# Altium schematic sheet SOM_IO1.SchDoc
size A4
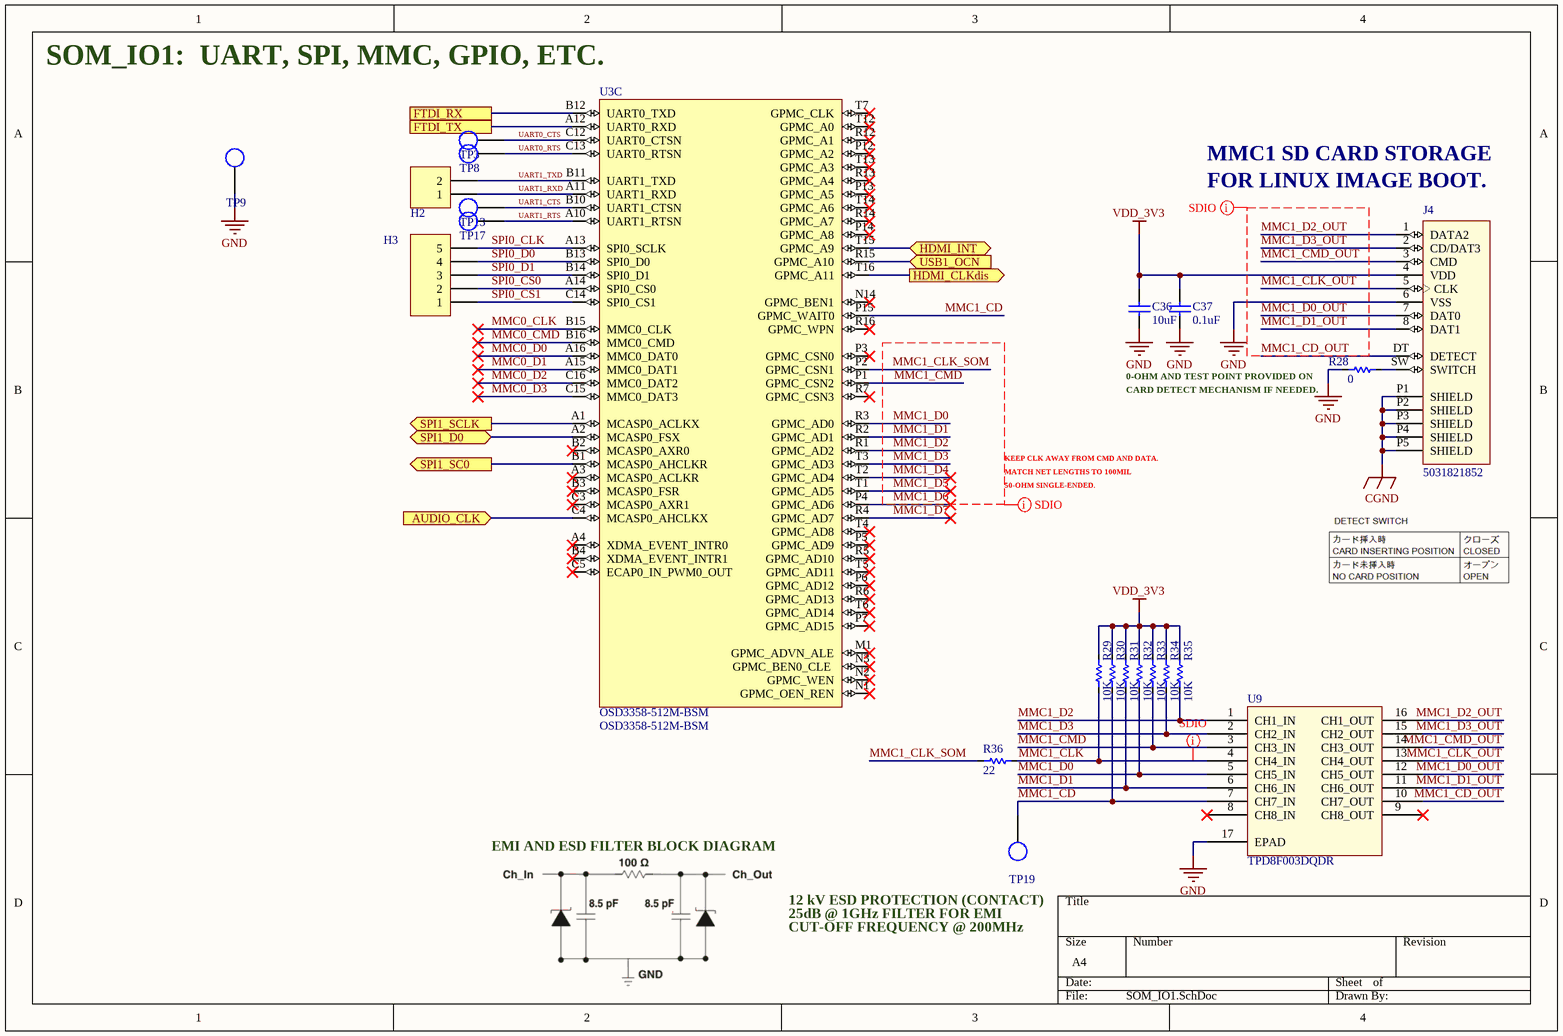
[diagram p0: SOM_IO1.SchDoc]

## Parts
C36  10uF  [CAP_0603]
C37  0.1uF  [CAP_0603]
H2  02p  [HEADER_2X1_2.54MM]  (value not drawn)
H3  06p  [HEADER_5X1_2.54MM]  (value not drawn)
J4  5031821852  [5031821852]
R28  0  [RES_0603]
R29  10K  [RES_0603]
R30  10K  [RES_0603]
R31  10K  [RES_0603]
R32  10K  [RES_0603]
R33  10K  [RES_0603]
R34  10K  [RES_0603]
R35  10K  [RES_0603]
R36  22  [RES_0603]
TP3  TP_SMD  [TP_SMD]  (value not drawn)
TP8  TP_SMD  [TP_SMD]  (value not drawn)
TP9  TP_SMD  [TP_SMD]  (value not drawn)
TP13  TP_SMD  [TP_SMD]  (value not drawn)
TP17  TP_SMD  [TP_SMD]  (value not drawn)
TP19  TP_SMD  [TP_SMD]  (value not drawn)
U3  OSD3358-512M-BSM  [BGA256C127P16X16_2100X2100X308]  (part C of 6)
U9  TPD8F003DQDR  [WSON-16_3.3MMX1.35MM]

## Ports
AUDIO_CLK (in), FTDI_RX, FTDI_TX, HDMI_CLKdis (out), HDMI_INT (bidir), SPI1_D0 (bidir), SPI1_SC0 (out), SPI1_SCLK (out), USB1_OCN (in)

## Nets
CGND: J4.P1(SHIELD) J4.P2(SHIELD) J4.P3(SHIELD) J4.P4(SHIELD) J4.P5(SHIELD)
GND: C36.1 C37.1 J4.6(VSS) R28.1 TP9.1 U9.17(EPAD)
VDD_3V3: C36.2 C37.2 J4.4(VDD) R29.2 R30.2 R31.2 R32.2 R33.2 R34.2 R35.2
AUDIO_CLK: U3.C4(MCASP0_AHCLKX) ; port AUDIO_CLK
FTDI_RX: U3.B12(UART0_TXD) ; port FTDI_RX
FTDI_TX: U3.A12(UART0_RXD) ; port FTDI_TX
HDMI_CLKdis: U3.T16(GPMC_A11) ; port HDMI_CLKdis
HDMI_INT: U3.T15(GPMC_A9) ; port HDMI_INT
MMC0_CLK: U3.B15(MMC0_CLK)
MMC0_CMD: U3.B16(MMC0_CMD)
MMC0_D0: U3.A16(MMC0_DAT0)
MMC0_D1: U3.A15(MMC0_DAT1)
MMC0_D2: U3.C16(MMC0_DAT2)
MMC0_D3: U3.C15(MMC0_DAT3)
MMC1_CD: R30.1 TP19.1 U3.P15(GPMC_WAIT0) U9.7(CH7_IN)
MMC1_CD_OUT: J4.DT(DETECT) U9.10(CH7_OUT)
MMC1_CLK: R29.1 R36.2 U9.4(CH4_IN)
MMC1_CLK_OUT: J4.5(CLK) U9.13(CH4_OUT)
MMC1_CLK_SOM: R36.1 U3.P2(GPMC_CSN1)
MMC1_CMD: R33.1 U3.P1(GPMC_CSN2) U9.3(CH3_IN)
MMC1_CMD_OUT: J4.3(CMD) U9.14(CH3_OUT)
MMC1_D0: R32.1 U3.R3(GPMC_AD0) U9.5(CH5_IN)
MMC1_D0_OUT: J4.7(DAT0) U9.12(CH5_OUT)
MMC1_D1: R31.1 U3.R2(GPMC_AD1) U9.6(CH6_IN)
MMC1_D1_OUT: J4.8(DAT1) U9.11(CH6_OUT)
MMC1_D2: R35.1 U3.R1(GPMC_AD2) U9.1(CH1_IN)
MMC1_D2_OUT: J4.1(DATA2) U9.16(CH1_OUT)
MMC1_D3: R34.1 U3.T3(GPMC_AD3) U9.2(CH2_IN)
MMC1_D3_OUT: J4.2(CD/DAT3) U9.15(CH2_OUT)
MMC1_D4: U3.T2(GPMC_AD4)
MMC1_D5: U3.T1(GPMC_AD5)
MMC1_D6: U3.P4(GPMC_AD6)
MMC1_D7: U3.R4(GPMC_AD7)
SPI0_CLK: H3.5 U3.A13(SPI0_SCLK)
SPI0_CS0: H3.2 U3.A14(SPI0_CS0)
SPI0_CS1: H3.1 U3.C14(SPI0_CS1)
SPI0_D0: H3.4 U3.B13(SPI0_D0)
SPI0_D1: H3.3 U3.B14(SPI0_D1)
SPI1_D0: U3.A2(MCASP0_FSX) ; port SPI1_D0
SPI1_SC0: U3.B1(MCASP0_AHCLKR) ; port SPI1_SC0
SPI1_SCLK: U3.A1(MCASP0_ACLKX) ; port SPI1_SCLK
UART0_CTS: TP3.1 U3.C12(UART0_CTSN)
UART0_RTS: TP8.1 U3.C13(UART0_RTSN)
UART1_CTS: TP13.1 U3.B10(UART1_CTSN)
UART1_RTS: TP17.1 U3.A10(UART1_RTSN)
UART1_RXD: H2.1 U3.A11(UART1_RXD)
UART1_TXD: H2.2 U3.B11(UART1_TXD)
USB1_OCN: U3.R15(GPMC_A10) ; port USB1_OCN
NetJ4_SW: J4.SW(SWITCH) R28.2

Not connected (* = marked no-connect by the designer): U3 A3(MCASP0_ACLKR)* A4(XDMA_EVENT_INTR0)* B2(MCASP0_AXR0)* B3(MCASP0_FSR)* B4(XDMA_EVENT_INTR1)* C3(MCASP0_AXR1)* C5(ECAP0_IN_PWM0_OUT)* M1(GPMC_ADVN_ALE)* N1(GPMC_OEN_REN)* N2(GPMC_WEN)* N3(GPMC_BEN0_CLE_)* N14(GPMC_BEN1)* P3(GPMC_CSN0)* P5(GPMC_AD9)* P6(GPMC_AD12)* P7(GPMC_AD15)* P12(GPMC_A2)* P13(GPMC_A5)* P14(GPMC_A8)* R5(GPMC_AD10)* R6(GPMC_AD13)* R7(GPMC_CSN3)* R12(GPMC_A1)* R13(GPMC_A4)* R14(GPMC_A7)* R16(GPMC_WPN)* T4(GPMC_AD8)* T5(GPMC_AD11)* T6(GPMC_AD14)* T7(GPMC_CLK)* T12(GPMC_A0)* T13(GPMC_A3)* T14(GPMC_A6)*; U9 8(CH8_IN)* 9(CH8_OUT)*

## Layout directives
net class SDIO1; net class Z50_SINGLE; rule Matched Net Lengths [Tolerance = 100mil]: MMC1_CD_OUT, MMC1_CLK, MMC1_CLK_OUT, MMC1_CLK_SOM, MMC1_CMD, MMC1_CMD_OUT, MMC1_D0, MMC1_D0_OUT, MMC1_D1, MMC1_D1_OUT, MMC1_D2, MMC1_D2_OUT, MMC1_D3, MMC1_D3_OUT, MMC1_D4, MMC1_D5, MMC1_D6

## Notes on the sheet
- SOM_IO1:  UART, SPI, MMC, GPIO, ETC.
- MMC1 SD CARD STORAGE
- (near J4) FOR LINUX IMAGE BOOT.
- 0-OHM AND TEST POINT PROVIDED ON
- CARD DETECT MECHANISM IF NEEDED.
- MATCH NET LENGTHS TO 100MIL
- 50-OHM SINGLE-ENDED.
- KEEP CLK AWAY FROM CMD AND DATA.
- EMI AND ESD FILTER BLOCK DIAGRAM
- (near TP19) 12 kV ESD PROTECTION (CONTACT)
- 25dB @ 1GHz FILTER FOR EMI
- CUT-OFF FREQUENCY @ 200MHz

## Library data of the parts
C36 = C0603C106M8PAC7867: CAP CER 10UF 10V X5R 0603; Manufacturer: KEMET; Ceramic Type: X7R; Tolerance: 20%; ComponentLink1Description: Manufacturer; ComponentLink1URL: http://www.we-online.de; Value: 10uF; Rated Voltage: 10V; Supplier Part No.: 399-14945-1-ND; Package Reference: CAP_0603; Package Description: 0603; Mounting Technology: SMD; Manufacturer Part No.: C0603C106M8PAC7867; Datasheet: https://content.kemet.com/datasheets/KEM_C1002_X7R_SMD.pdf; Supplier: Digi-Key; ComponentLink2Description: Datasheet; ComponentLink2URL: https://content.kemet.com/datasheets/KEM_C1002_X7R_SMD.pdf
C37 = C0603C104M4RACTU: CAP CER 0.1UF 16V X7R 0603; Manufacturer: KEMET; Tolerance: 20%; ComponentLink1Description: Manufacturer; ComponentLink1URL: http://www.we-online.de; Value: 0.1uF; Rated Voltage: 16V; Ceramic Type: X7R; Supplier Part No.: 399-1099-1-ND; Package Reference: CAP_0603; Package Description: 0603; Mounting Technology: SMD; Manufacturer Part No.: C0603C104M4RACTU; Datasheet: https://content.kemet.com/datasheets/KEM_C1002_X7R_SMD.pdf; Supplier: Digi-Key; ComponentLink2Description: Datasheet; ComponentLink2URL: https://content.kemet.com/datasheets/KEM_C1002_X7R_SMD.pdf
H2 = 61300211121: CONN HEADER VERT 2POS 2.54MM; Manufacturer: Wurth Elektronik; ComponentLink1Description: Manufacturer; ComponentLink1URL: http://www.we-online.de; ComponentLink2Description: Datasheet; ComponentLink2URL: http://katalog.we-online.de/em/datasheet/6130xx11121.pdf; Supplier Part No.: 732-5315-ND; Supplier: Digi-Key; Package Reference: HEADER_2X1_2.54MM; Package Description: Header 2-pin 2.54mm 100mils; Mounting Technology: THRU; Manufacturer Part No.: 61300211121; Datasheet: https://www.we-online.de/katalog/datasheet/6130xx11121.pdf
H3 = 61300511121: CONN HEADER VERT 6POS 2.54MM; Manufacturer: Wurth Elektronik; Supplier: Digi-Key; ComponentLink1Description: Manufacturer; ComponentLink1URL: http://www.we-online.de; ComponentLink2Description: Datasheet; ComponentLink2URL: http://katalog.we-online.de/em/datasheet/6130xx11121.pdf; Manufacturer Part No.: 61300511121; Supplier Part No.: 732-5318-ND; Datasheet: https://www.we-online.de/katalog/datasheet/6130xx11121.pdf; Package Reference: HEADER_5X1_2.54MM; Mounting Technology: THRU; Package Description: Header, 5-pin, single-row, 2.54mm/0.100" pitch
J4 = 5031821852: MICRO SD NORMAL ULTRALOWPRO8CKTE; Manufacturer: Molex; Supplier: Digi-Key; Manufacturer Part No.: 5031821852; Supplier Part No.: WM12834CT-ND; Datasheet: *; Package Description: 10 (8 + 2) Position Card Connector microSD™ Surface Mount, Right Angle Gold; Package Reference: 5031821852; Mounting Technology: SMD
R28 = RC0603JR-070RL: RES SMD 0 OHM JUMPER 1/10W 0603; Manufacturer: Yageo; Manufacturer Part No.: RC0603JR-070RL; Date: 2020; ComponentLink1Description: Manufacturer Link; ComponentLink1URL: http://www.vishay.com/company/brands/dale/; ComponentLink2Description: Datasheet; ComponentLink2URL: http://www.vishay.com/docs/20035/dcrcwe3.pdf; Supplier: Digikey; Supplier Part No.: 311-0.0GRCT-ND; Datasheet: https://www.yageo.com/upload/media/product/productsearch/datasheet/rchip/PYu-RC_Group_51_RoHS_L_10.pdf; Package Reference: RES_0603; Package Description: 0603; Mounting Technology: SMD; Value: 0; Power Rating: 1/10W
R29-R35 = RC0603FR-0710KL: RES SMD 10K OHM 1% 1/10W 0603; Manufacturer: Yageo; Tolerance: 1%; Manufacturer Part No.: RC0603FR-0710KL; Date: 2020; ComponentLink1Description: Manufacturer Link; ComponentLink1URL: http://www.vishay.com/company/brands/dale/; ComponentLink2Description: Datasheet; ComponentLink2URL: http://www.vishay.com/docs/20035/dcrcwe3.pdf; Supplier: Digikey; Supplier Part No.: 311-10.0KHRCT-ND; Datasheet: https://www.yageo.com/upload/media/product/productsearch/datasheet/rchip/PYu-RC_Group_51_RoHS_L_10.pdf; Package Reference: RES_0603; Package Description: 0603; Mounting Technology: SMD; Value: 10K; Power Rating: 1/10W
R36 = RC0603JR-0722RL: RES SMD 22 OHM 5% 1/10W 0603; Manufacturer: Yageo; Tolerance: 5%; Manufacturer Part No.: RC0603JR-0722RL; Date: 2020; ComponentLink1Description: Manufacturer Link; ComponentLink1URL: http://www.vishay.com/company/brands/dale/; ComponentLink2Description: Datasheet; ComponentLink2URL: http://www.vishay.com/docs/20035/dcrcwe3.pdf; Supplier: Digikey; Supplier Part No.: 311-22GRCT-ND; Datasheet: https://www.yageo.com/upload/media/product/productsearch/datasheet/rchip/PYu-RC_Group_51_RoHS_L_10.pdf; Package Reference: RES_0603; Package Description: 0603; Mounting Technology: SMD; Power Rating: 1/10W; Value: 22
U3 = SOM-OSD3358-512M-BSM: OSD3358-512M-BSM , 256-FBGA, 21mmx21mmx3mm; Manufacturer: Octavo Systems; Package: FBGA; Pin Count: 256-ball; Mounting Technology: SMD; ComponentLink1Description: Manufacturer URL; ComponentLink1URL: http://www.octavosystems.com/; PartNumber: OSD3358-512M-BSM; Package Description: 256-Ball Grid Array, 21x21x3 mm, Pitch 1.27 mm; Package Reference: FBGA-256; Supplier: Digi-Key; Supplier Part No.: 1676-1002-ND
U9 = TPD8F003DQDR: FILTER RC(PI) 100 OHM/8.5PF SMD WITH ESD PROTECTION; Manufacturer: Texas Instruments; ESD Discharge (Contact): 12 kV; ESD Discharge (Air Gap): 20 kV; Cut-Off Frequency: 200 MHz; Attenuation: 25dB @ 1Ghz; Manufacturer Part No.: TPD8F003DQDR; Supplier: Digi-Key; Mounting Technology: SMD; Package Reference: 16-WFDFN Exposed Pad, 0.79mm height; Package Description: WSON-16_3.3MMX1.35MM; Datasheet: https://www.ti.com/lit/ds/symlink/tpd8f003.pdf; Supplier Part No.: 296-25803-1-ND